# EAGLE design WiiIr (EAGLE 6.5.0)
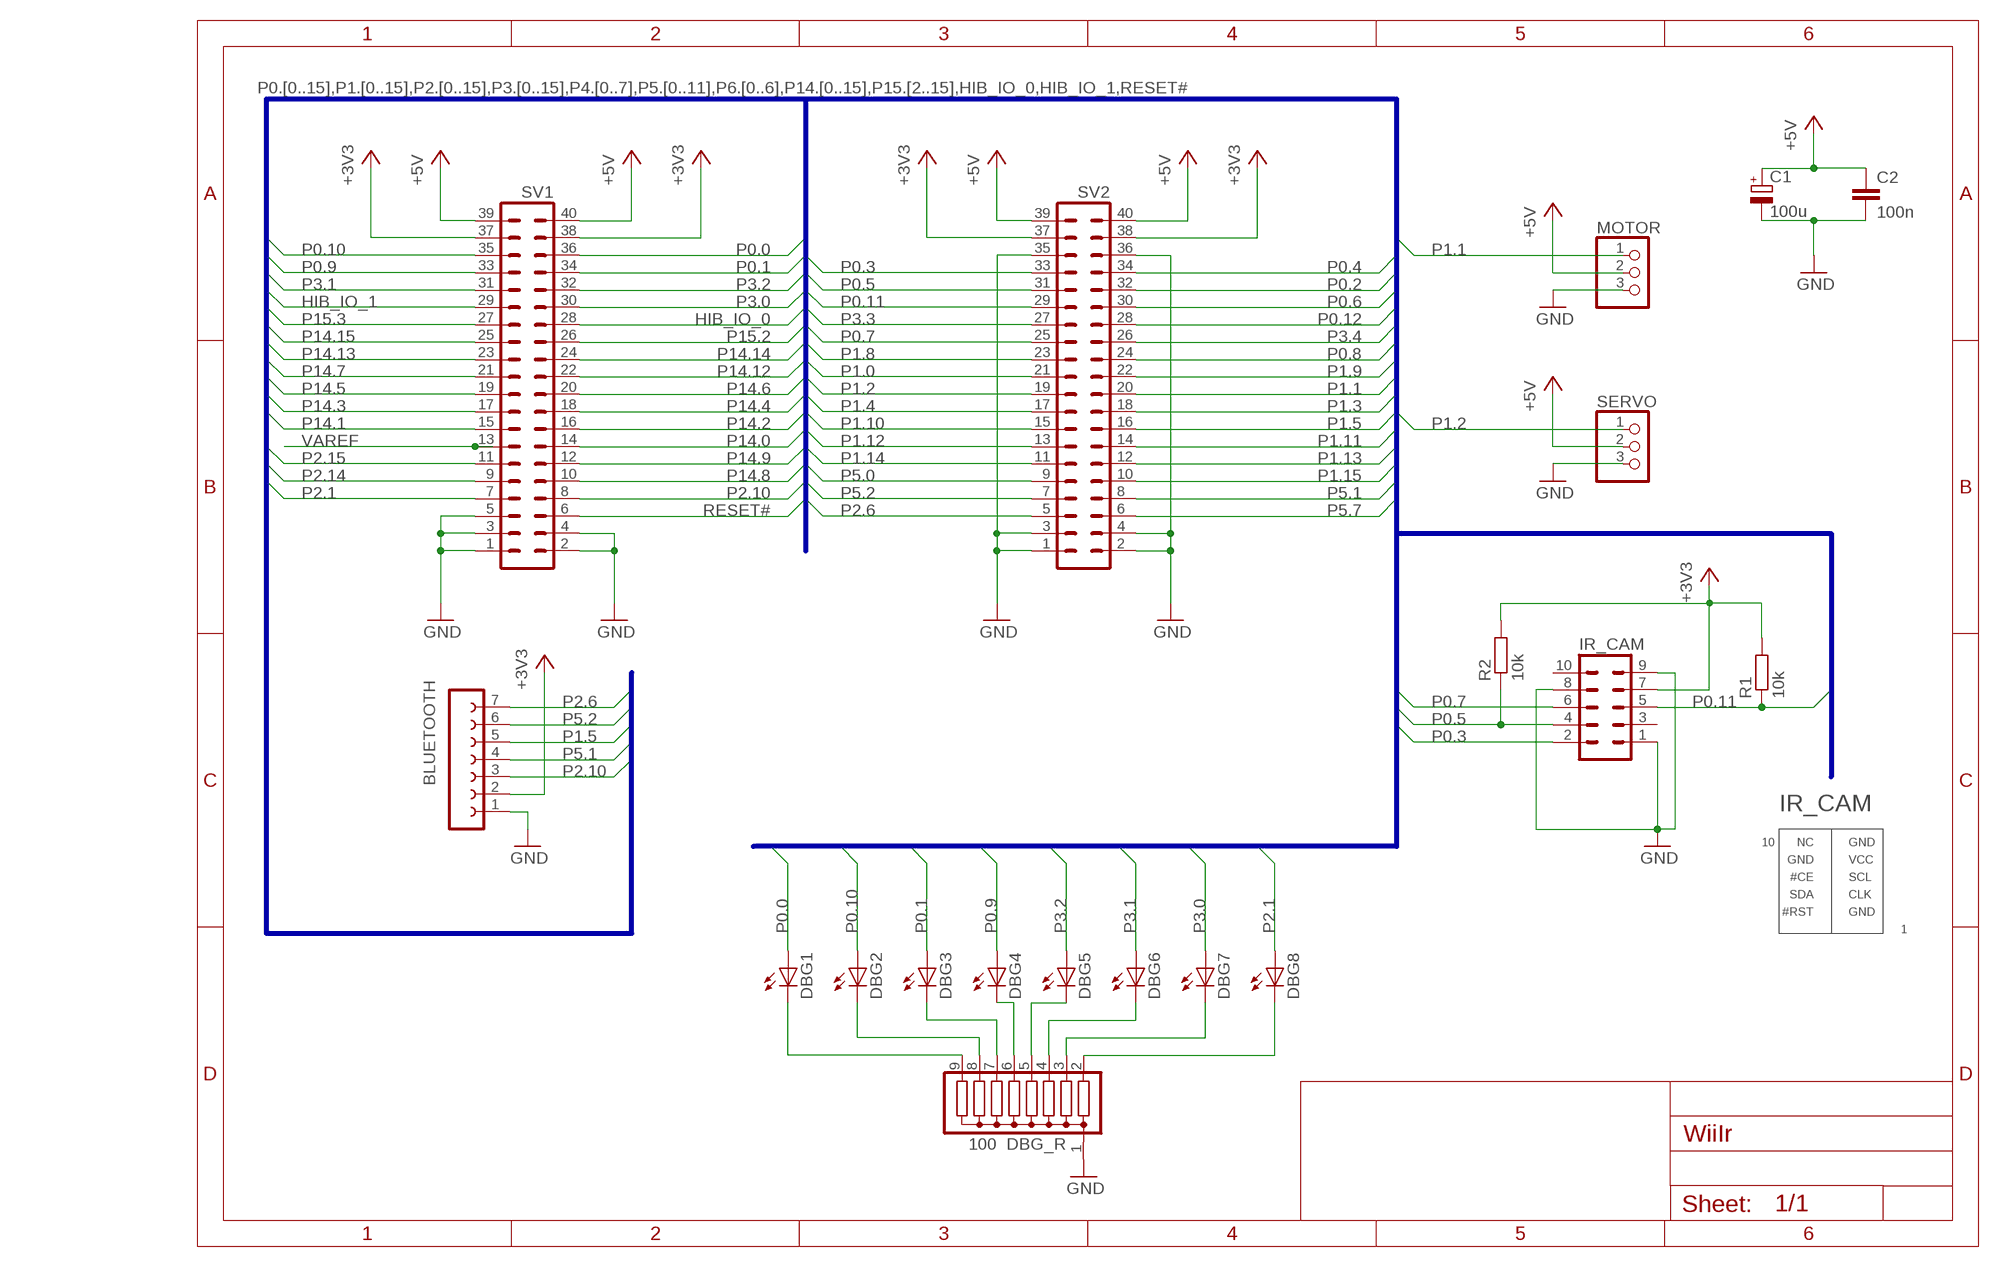
[diagram p0: schematic, sheet 1]

## Parts
BLUETOOTH  FE07-1  [FE07]
C1  100u  CPOL-EUE2.5-7  [E2,5-7]
C2  100n  C-EU025-025X050  [C025-025X050]
DBG1  LEDSQR2X5  [LED2X5]
DBG2  LEDSQR2X5  [LED2X5]
DBG3  LEDSQR2X5  [LED2X5]
DBG4  LEDSQR2X5  [LED2X5]
DBG5  LEDSQR2X5  [LED2X5]
DBG6  LEDSQR2X5  [LED2X5]
DBG7  LEDSQR2X5  [LED2X5]
DBG8  LEDSQR2X5  [LED2X5]
DBG_R  100  G08R  [SIL9]
IR_CAM  ML10  [ML10]
MOTOR  PINHD-1X3/90  [1X03/90]
R1  10k  R-EU_0207/12  [0207/12]
R2  10k  R-EU_0207/10  [0207/10]
SERVO  PINHD-1X3/90  [1X03/90]
SV1  MA20-2  [MA20-2]
SV2  MA20-2  [MA20-2]

## Nets
+3V3: BLUETOOTH.2 IR_CAM.7 R1.2 R2.2 SV1.37 SV1.38 SV2.37 SV2.38
+5V: C1.+ C2.1 MOTOR.2 SERVO.2 SV1.39 SV1.40 SV2.39 SV2.40
GND: BLUETOOTH.1 C1.- C2.2 DBG_R.1 IR_CAM.1 IR_CAM.8 IR_CAM.9 MOTOR.3 SERVO.3 SV1.1 SV1.2 SV1.3 SV1.4 SV1.5 SV2.1 SV2.2 SV2.3 SV2.4 SV2.35 SV2.36
HIB_IO_0: SV1.28
HIB_IO_1: SV1.29
N$2: DBG1.K(C) DBG_R.9
N$3: DBG2.K(C) DBG_R.8
N$4: DBG3.K(C) DBG_R.7
N$5: DBG4.K(C) DBG_R.6
N$6: DBG5.K(C) DBG_R.5
N$7: DBG6.K(C) DBG_R.4
N$8: DBG7.K(C) DBG_R.3
N$9: DBG8.K(C) DBG_R.2
P0.0: DBG1.A SV1.36
P0.1: DBG3.A SV1.34
P0.2: SV2.32
P0.3: IR_CAM.2 SV2.33
P0.4: SV2.34
P0.5: IR_CAM.4 R2.1 SV2.31
P0.6: SV2.30
P0.7: IR_CAM.6 SV2.25
P0.8: SV2.24
P0.9: DBG4.A SV1.33
P0.10: DBG2.A SV1.35
P0.11: IR_CAM.5 R1.1 SV2.29
P0.12: SV2.28
P1.0: SV2.21
P1.1: MOTOR.1 SV2.20
P1.2: SERVO.1 SV2.19
P1.3: SV2.18
P1.4: SV2.17
P1.5: BLUETOOTH.5 SV2.16
P1.8: SV2.23
P1.9: SV2.22
P1.10: SV2.15
P1.11: SV2.14
P1.12: SV2.13
P1.13: SV2.12
P1.14: SV2.11
P1.15: SV2.10
P2.1: DBG8.A SV1.7
P2.6: BLUETOOTH.7 SV2.5
P2.10: BLUETOOTH.3 SV1.8
P2.14: SV1.9
P2.15: SV1.11
P3.0: DBG7.A SV1.30
P3.1: DBG6.A SV1.31
P3.2: DBG5.A SV1.32
P3.3: SV2.27
P3.4: SV2.26
P5.0: SV2.9
P5.1: BLUETOOTH.4 SV2.8
P5.2: BLUETOOTH.6 SV2.7
P5.7: SV2.6
P14.0: SV1.14
P14.1: SV1.15
P14.2: SV1.16
P14.3: SV1.17
P14.4: SV1.18
P14.5: SV1.19
P14.6: SV1.20
P14.7: SV1.21
P14.8: SV1.10
P14.9: SV1.12
P14.12: SV1.22
P14.13: SV1.23
P14.14: SV1.24
P14.15: SV1.25
P15.2: SV1.26
P15.3: SV1.27
RESET#: SV1.6
VAREF: SV1.13
Unconnected: IR_CAM.3 IR_CAM.10

## Buses
P0.[0..15],P1.[0..15],P2.[0..15],P3.[0..15],P4.[0..7],P5.[0..11],P6.[0..6],P14.[0..15],P15.[2..15],HIB_IO_0,HIB_IO_1,RESET#

## Notes on the sheet
- IR_CAM
- 10 | NC | GND
- GND | VCC
- #CE | SCL
- SDA | CLK
- #RST | GND
- 1

## Library data of the parts
BLUETOOTH = con-lsta:FE07-1: FEMALE HEADER; OC_FARNELL: unknown; OC_NEWARK: unknown
C1 = resistor:CPOL-EU: POLARIZED CAPACITOR, European symbol
C2 = resistor:C-EU: CAPACITOR, European symbol
DBG1-DBG8 = led:LED: LED OSRAM: - CHIPLED LG R971, LG N971, LY N971, LG Q971, LY Q971, LO R971, LY R971 LH N974, LH R974 LS Q976, LO Q976, LY Q976 LO Q996 - Hyper CHIPLED LW Q18S LB Q993, LB Q99A, LB R99A - SideLED LS A670, LO A670, LY A670, LG A670, LP A670 LB A673, LV A673, LT A673, LW A673 LH A674 LY A675 LS A676, LA A676, LO A676, LY A676, LW A676 LS A679, LY A679, LG A679 - Hyper Micro SIDELED® LS Y876, LA Y876, LO Y876, LY Y876 LT Y87S - SmartLED LW L88C, LW L88S LB L89C, LB L89S, LG L890 LS L89K, LO L89K, LY L89K LS L896, LA L896, LO L896, LY L896 - TOPLED LS T670, LO T670, LY T670, LG T670, LP T670 LSG T670, LSP T670, LSY T670, LOP T670, LYG T670 LG T671, LOG T671, LSG T671 LB T673, LV T673, LT T673, LW T673 LH T674 LS T676, LA T676, LO T676, LY T676, LB T676, LH T676, LSB T676, LW T676 LB T67C, LV T67C, LT T67C, LS T67K, LO T67K, LY T67K, LW E67C LS E67B, LA E67B, LO E67B, LY E67B, LB E67C, LV E67C, LT E67C LW T67C LS T679, LY T679, LG T679 LS T770, LO T770, LY T770, LG T770, LP T770 LB T773, LV T773, LT T773, LW T773 LH T774 LS E675, LA E675, LY E675, LS T675 LS T776, LA T776, LO T776, LY T776, LB T776 LHGB T686 LT T68C, LB T68C - Hyper Mini TOPLED® LB M676 - Mini TOPLED Santana® LG M470 LS M47K, LO M47K, LY M47K Source: http://www.osram.convergy.de LUXEON: - LUMILED® LXK2-PW12-R00, LXK2-PW12-S00, LXK2-PW14-U00, LXK2-PW14-V00 LXK2-PM12-R00, LXK2-PM12-S00, LXK2-PM14-U00 LXK2-PE12-Q00, LXK2-PE12-R00, LXK2-PE12-S00, LXK2-PE14-T00, LXK2-PE14-U00 LXK2-PB12-K00, LXK2-PB12-L00, LXK2-PB12-M00, LXK2-PB14-N00, LXK2-PB14-P00, LXK2-PB14-Q00 LXK2-PR12-L00, LXK2-PR12-M00, LXK2-PR14-Q00, LXK2-PR14-R00 LXK2-PD12-Q00, LXK2-PD12-R00, LXK2-PD12-S00 LXK2-PH12-R00, LXK2-PH12-S00 LXK2-PL12-P00, LXK2-PL12-Q00, LXK2-PL12-R00 Source: www.luxeon.com KINGBRIGHT: KA-3528ASYC Source: www.kingbright.com
DBG_R = resistor-sil:G08R: SIL RESISTOR; OC_FARNELL: unknown; OC_NEWARK: unknown
IR_CAM = con-harting-ml:ML10: HARTING; OC_FARNELL: unknown; OC_NEWARK: unknown
MOTOR SERVO = pinhead:PINHD-1X3: PIN HEADER
R1 R2 = resistor:R-EU_: RESISTOR, European symbol
SV1 SV2 = con-lstb:MA20-2: PIN HEADER; OC_FARNELL: unknown; OC_NEWARK: unknown

## Board
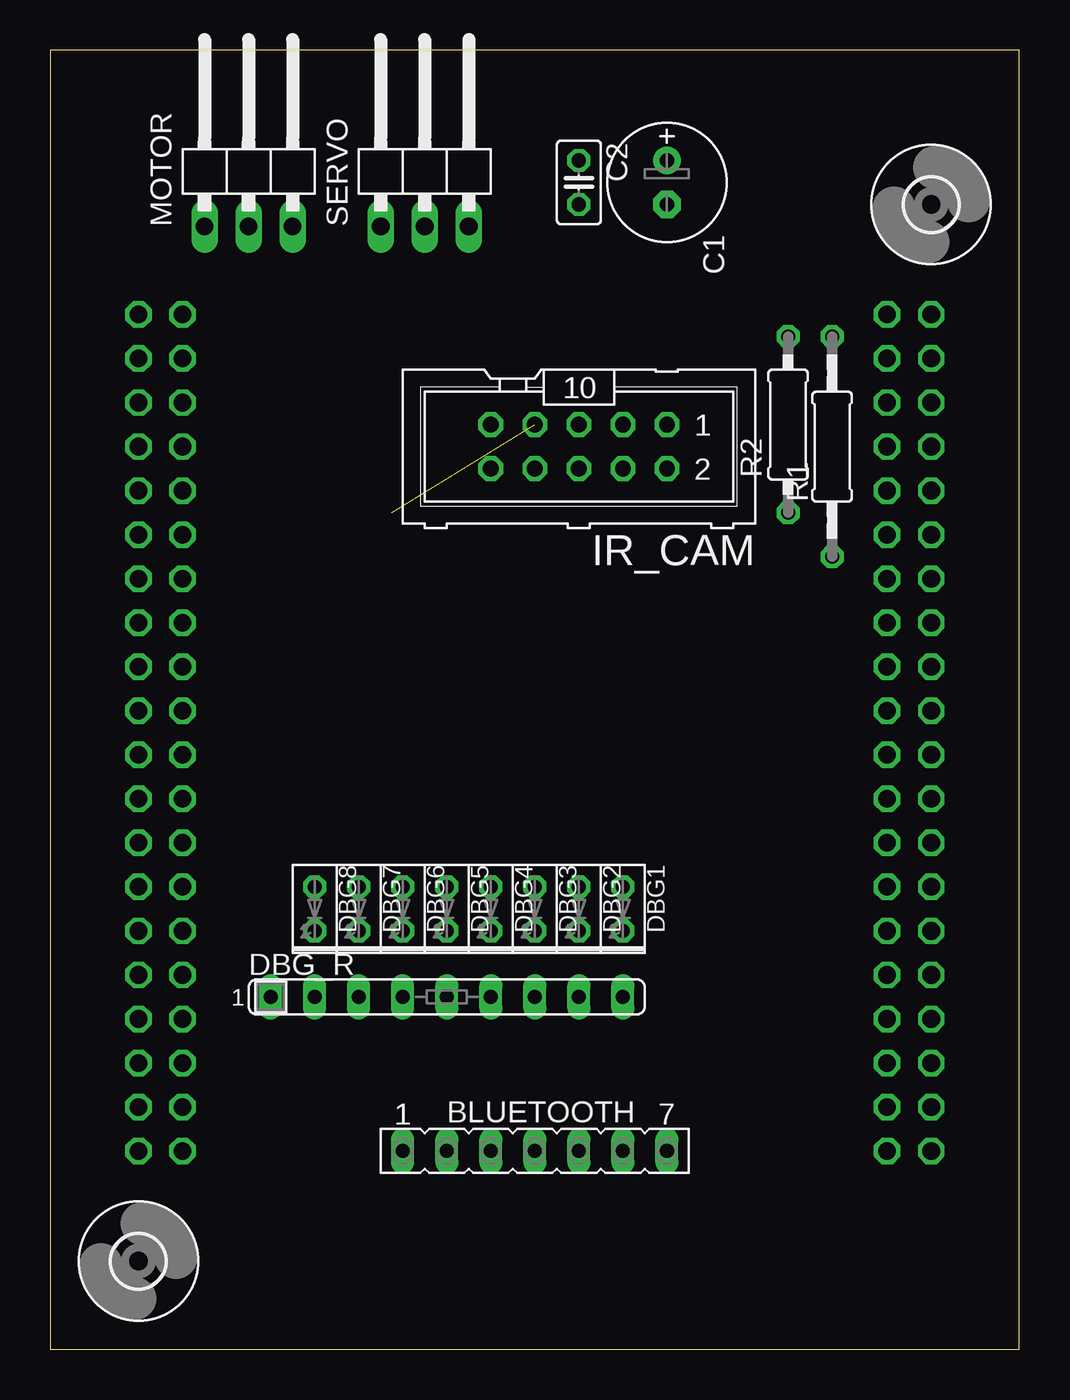
[diagram p1: board, top side]
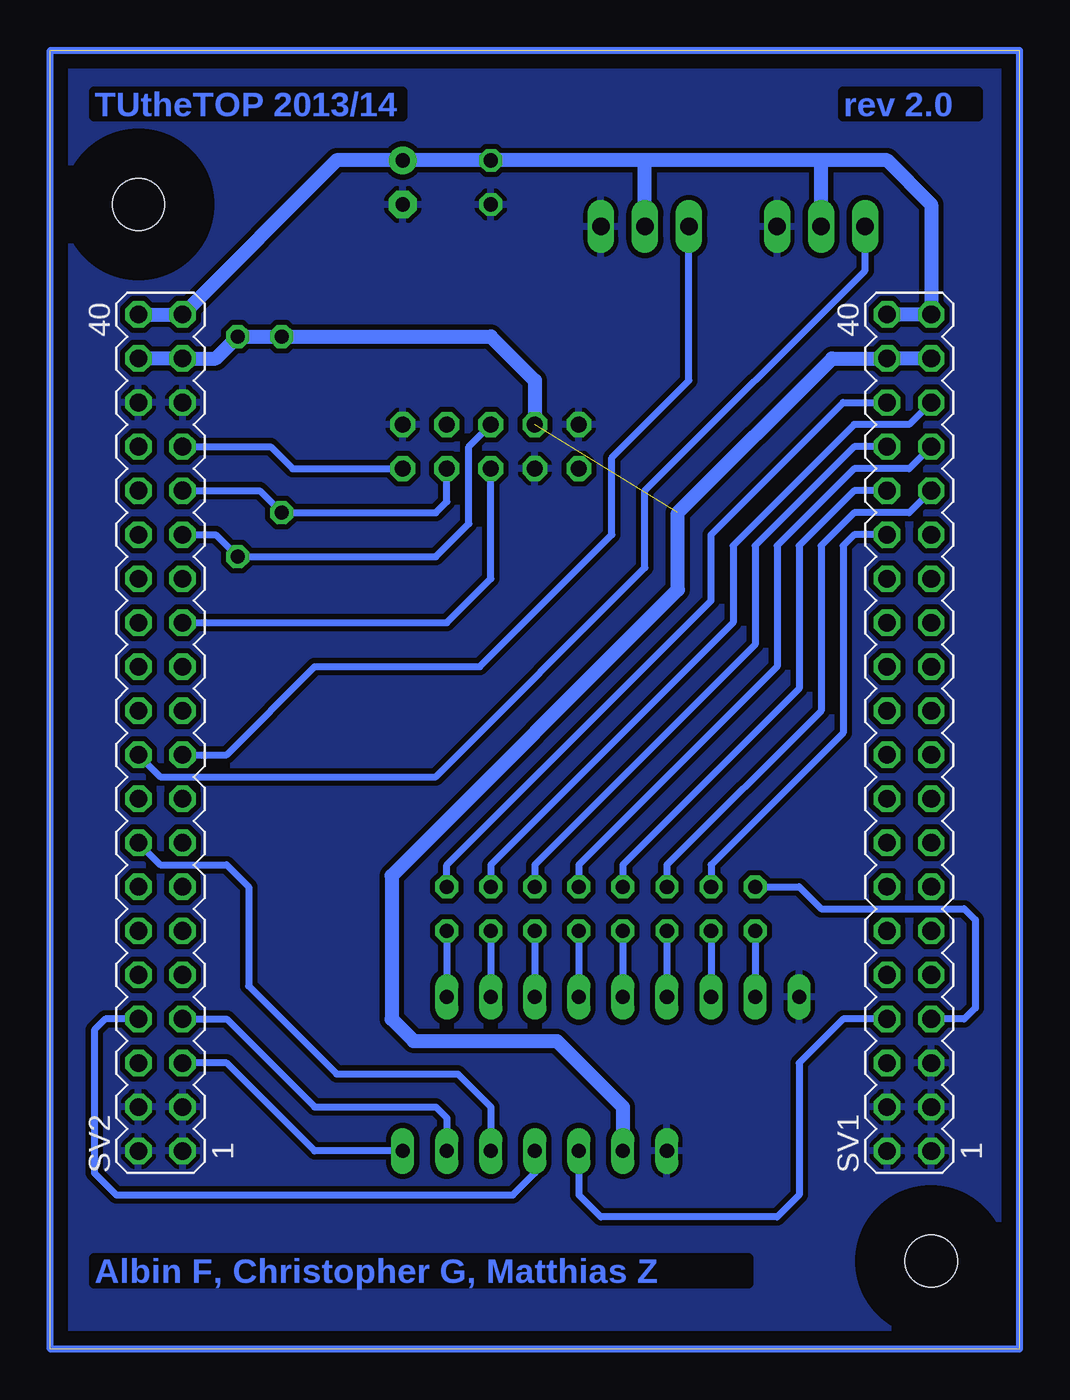
[diagram p2: board, bottom side, seen from below]

Size 55.88 x 74.93 mm. Coordinates in mm from the lower left corner, seen from the top.
Outline: 0,0 55.88,0 55.88,74.93 0,74.93 0,0
Copper layers (1*16): Top 0.035mm / dielectric 1.5mm / Bottom 0.035mm
Design rules "default *": minimum track width 10mil, minimum drill 24mil, track to track 12mil, track to pad 12mil, pad to pad 12mil, via to via 12mil, smd to smd 8mil, copper to edge 40mil, drill to drill 8mil, minimum pad ring 10mil, minimum via ring 8mil, stop-mask expansion 4mil, vias tented up to drill 0mil, thermal gap 10mil

### Footprints (pad centres in the part's own frame; a part is rotated, then mirrored left to right if it is on the bottom)
FE07 = drill 0.813 long: 1 -7.62,0; 2 -5.08,0; 3 -2.54,0; 4 0,0; 5 2.54,0; 6 5.08,0; 7 7.62,0
E2,5-7 = drill 0.813 pad 1.6: + -1.27,0 | drill 0.813 pad 1.6 octagon: - 1.27,0
C025-025X050 = drill 0.813 octagon: 1 -1.27,0; 2 1.27,0
LED2X5 = drill 0.813 octagon: A -1.27,0; K 1.27,0
SIL9 = drill 0.813 long: 1 -10.16,0; 2 -7.62,0; 3 -5.08,0; 4 -2.54,0; 5 0,0; 6 2.54,0; 7 5.08,0; 8 7.62,0; 9 10.16,0
ML10 = drill 0.914 octagon: 1 -5.08,-1.27; 2 -5.08,1.27; 3 -2.54,-1.27; 4 -2.54,1.27; 5 0,-1.27; 6 0,1.27; 7 2.54,-1.27; 8 2.54,1.27; 9 5.08,-1.27; 10 5.08,1.27
1X03/90 = drill 1.016 long: 1 -2.54,-3.81; 2 0,-3.81; 3 2.54,-3.81
0207/12 = drill 0.813 octagon: 1 -6.35,0; 2 6.35,0
0207/10 = drill 0.813 octagon: 1 -5.08,0; 2 5.08,0
MA20-2 = drill 1.016 octagon: 1 -24.13,-1.27; 2 -24.13,1.27; 3 -21.59,-1.27; 4 -21.59,1.27; 5 -19.05,-1.27; 6 -19.05,1.27; 7 -16.51,-1.27; 8 -16.51,1.27; 9 -13.97,-1.27; 10 -13.97,1.27; 11 -11.43,-1.27; 12 -11.43,1.27; 13 -8.89,-1.27; 14 -8.89,1.27; 15 -6.35,-1.27; 16 -6.35,1.27; 17 -3.81,-1.27; 18 -3.81,1.27; 19 -1.27,-1.27; 20 -1.27,1.27; 21 1.27,-1.27; 22 1.27,1.27; 23 3.81,-1.27; 24 3.81,1.27; 25 6.35,-1.27; 26 6.35,1.27; 27 8.89,-1.27; 28 8.89,1.27; 29 11.43,-1.27; 30 11.43,1.27; 31 13.97,-1.27; 32 13.97,1.27; 33 16.51,-1.27; 34 16.51,1.27; 35 19.05,-1.27; 36 19.05,1.27; 37 21.59,-1.27; 38 21.59,1.27; 39 24.13,-1.27; 40 24.13,1.27
3,0 = hole 3: 0,0

### Placement (x,y rotation side)
BLUETOOTH  27.94,11.43 0 top
C1  35.56,67.31 270 top
C2  30.48,67.31 270 top
DBG1  33.02,25.4 270 top
DBG2  30.48,25.4 270 top
DBG3  27.94,25.4 270 top
DBG4  25.4,25.4 270 top
DBG5  22.86,25.4 270 top
DBG6  20.32,25.4 270 top
DBG7  17.78,25.4 270 top
DBG8  15.24,25.4 270 top
DBG_R  22.86,20.32 0 top
IR_CAM  30.48,52.07 180 top
MOTOR  11.43,68.58 0 top
R1  45.09,52.07 90 top
R2  42.55,53.34 90 top
SERVO  21.59,68.58 0 top
SV1  6.35,35.56 90 bottom
SV2  49.53,35.56 90 bottom
U$1  [3,0]  5.08,5.08 0 top
U$2  [3,0]  50.8,66.04 0 top

### Tracks (layer width: path | path; a pad name or v marks a point on that pad's centre or on a via)
+3V3  (1 unrouted)
  Bottom 0.813: SV2.38 SV2.37 46.35,57.15 R1.2 R2.2 30.48,58.42 27.94,55.88 IR_CAM.7 | SV1.37 SV1.38 10.79,57.15 19.68,48.26 19.68,43.81 36.2,27.3 36.2,19.05 34.92,17.78 26.67,17.78 22.86,13.97 BLUETOOTH.2
+5V
  Bottom 0.813: SV2.40 SV2.39 39.37,68.58 C1.+ C2.1 21.59,68.58 | SV1.40 SV1.39 5.08,66.04 7.62,68.58 11.43,68.58 | 11.43,68.58 21.59,68.58 | MOTOR.2 11.43,68.58 | SERVO.2 21.59,68.58
GND
  pour Bottom (isolate 0.305): -2.54,77.47 58.42,77.47 58.42,-3.81 -2.54,-3.81
N$1
  Bottom 0.406: 0,0 55.88,0 55.88,74.93 0,74.93 0,0
N$2
  Bottom 0.406: DBG1.K DBG_R.9
N$3
  Bottom 0.406: DBG2.K DBG_R.8
N$4
  Bottom 0.406: DBG3.K DBG_R.7
N$5
  Bottom 0.406: DBG4.K DBG_R.6
N$6
  Bottom 0.406: DBG5.K DBG_R.5
N$7
  Bottom 0.406: DBG6.K DBG_R.4
N$8
  Bottom 0.406: DBG7.K DBG_R.3
N$9
  Bottom 0.406: DBG8.K DBG_R.2
P0.0
  Bottom 0.406: DBG1.A 33.02,27.94 17.78,43.18 17.78,46.99 10.16,54.61 SV1.36
P0.1
  Bottom 0.406: SV1.34 9.53,52.07 15.24,46.35 15.24,40.64 27.94,27.94 DBG3.A
P0.3
  Bottom 0.406: SV2.33 43.18,52.07 41.91,50.8 IR_CAM.2
P0.5
  Bottom 0.406: IR_CAM.4 33.02,48.9 33.66,48.26 R2.1 43.81,49.53 SV2.31
P0.7
  Bottom 0.406: SV2.25 33.02,41.91 30.48,44.45 IR_CAM.6
P0.9
  Bottom 0.406: SV1.33 6.35,50.8 9.53,50.8 13.97,46.35 13.97,39.37 25.4,27.94 DBG4.A
P0.10
  Bottom 0.406: SV1.35 6.35,53.34 9.53,53.34 16.51,46.35 16.51,41.91 30.48,27.94 DBG2.A
P0.11
  Bottom 0.406: IR_CAM.5 31.75,52.07 31.75,47.62 33.66,45.72 R1.1 46.35,46.99 SV2.29
P1.1
  Bottom 0.406: SV2.20 49.53,33.02 33.66,33.02 21.59,45.09 21.59,49.53 8.89,62.23 MOTOR.1
P1.2
  Bottom 0.406: SV2.19 45.72,34.29 40.64,39.37 31.11,39.37 23.5,46.99 23.5,51.44 19.05,55.88 SERVO.1
P1.5
  Bottom 0.406: SV2.16 49.53,27.94 45.72,27.94 44.45,26.67 44.45,20.95 39.37,15.88 32.38,15.88 30.48,13.97 BLUETOOTH.5
P2.1
  Bottom 0.406: DBG8.A 12.7,26.67 11.43,25.4 3.17,25.4 2.54,24.77 2.54,19.68 3.17,19.05 SV1.7
P2.6
  Bottom 0.406: BLUETOOTH.7 40.64,11.43 45.72,16.51 SV2.5
P2.10
  Bottom 0.406: SV1.8 10.16,19.05 12.7,16.51 12.7,8.89 13.97,7.62 24.13,7.62 25.4,8.89 BLUETOOTH.3
P3.0
  Bottom 0.406: SV1.30 9.53,46.99 10.16,46.35 10.16,35.56 17.78,27.94 DBG7.A
P3.1
  Bottom 0.406: SV1.31 6.35,48.26 9.53,48.26 11.43,46.35 11.43,36.83 20.32,27.94 DBG6.A
P3.2
  Bottom 0.406: SV1.32 9.53,49.53 12.7,46.35 12.7,38.1 22.86,27.94 DBG5.A
P5.1
  Bottom 0.406: BLUETOOTH.4 27.94,10.16 29.21,8.89 52.07,8.89 53.34,10.16 53.34,18.41 52.7,19.05 SV2.8
P5.2
  Bottom 0.406: SV2.7 45.72,19.05 40.64,13.97 33.66,13.97 33.02,13.34 BLUETOOTH.6

### Text on the board
Bottom: rev 2.0 | TUtheTOP 2013/14 | Albin F, Christopher G, Matthias Z